# Altium schematic sheet Welder_PSU.SchDoc
size A4; SheetNumber: 1; SheetTotal: 3
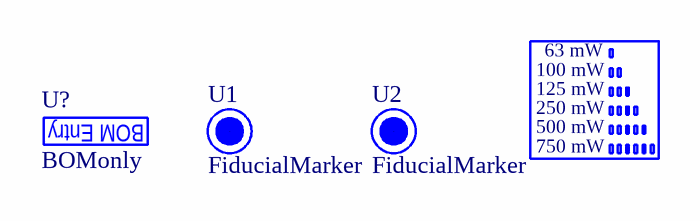
[diagram p0: Welder_PSU.SchDoc]

## Parts
(Parts that share a designator on the sheet are numbered #1, #2 ... from top to bottom, then left to right.)
U1  FiducialMarker  [FiducialMarker]  (no BOM)
U2  FiducialMarker  [FiducialMarker]  (no BOM)
U?#1  BOMonly  (mechanical)
U?#2  ROVERVIEW  (value not drawn)  (graphical)

## Nets

Not connected (* = marked no-connect by the designer): U1 1; U2 1

## Notes on the sheet
- Assembly variant:
- DIN ISO 2768-mK
- DIN ISO 8015
- standards
- general
- replace for
- DIN EN ISO 1302
- surface
- material number
- description
- document
- number
- replace for index
- type
- version
- date
- drawn by
- checked
- File:
- mod.
- ind.
- quan.
- change number
- sheet
- of
- EBB
- ESP
- (in symbol 9) 63 mW; 100 mW; 125 mW; 250 mW; 500 mW; 750 mW; BOM Entry

## Library data of the parts
U1 U2 = 2: Part: Layout; ID: 2; Properties: Fiducial Marker for SMD Placement; Value: FiducialMarker; Manufacturer: *; Package: *; Price1k: *; Price100k: *; Distributor: *; Calculation: *; Information: *; ComponentLink1URL: C:\AltiumDesigner\Datasheets\Others\FiducialMarker\; ComponentLink1Description: Files Fiducial Marker
U?#1 = 9: Manufacturer: MANUFAKTURER; ID: 9; Properties: DESCRIBE THE THING YOU WANT TO HAVE IN THE BOM; Part: BOMonly; Value: *; Package: -; Price1k: ?; Price100k: ?; Distributor: -; Calculation: *; Information: -; ComponentLink1URL: -; ComponentLink1Description: -
U?#2 = 9: Legend Resistor Power; ID: 9; Part: ROverView; Value: ROverView; Properties: Legend Resistor Power; Information: *